# EAGLE design Curvetracer-Mk1 (EAGLE 7.7.0)
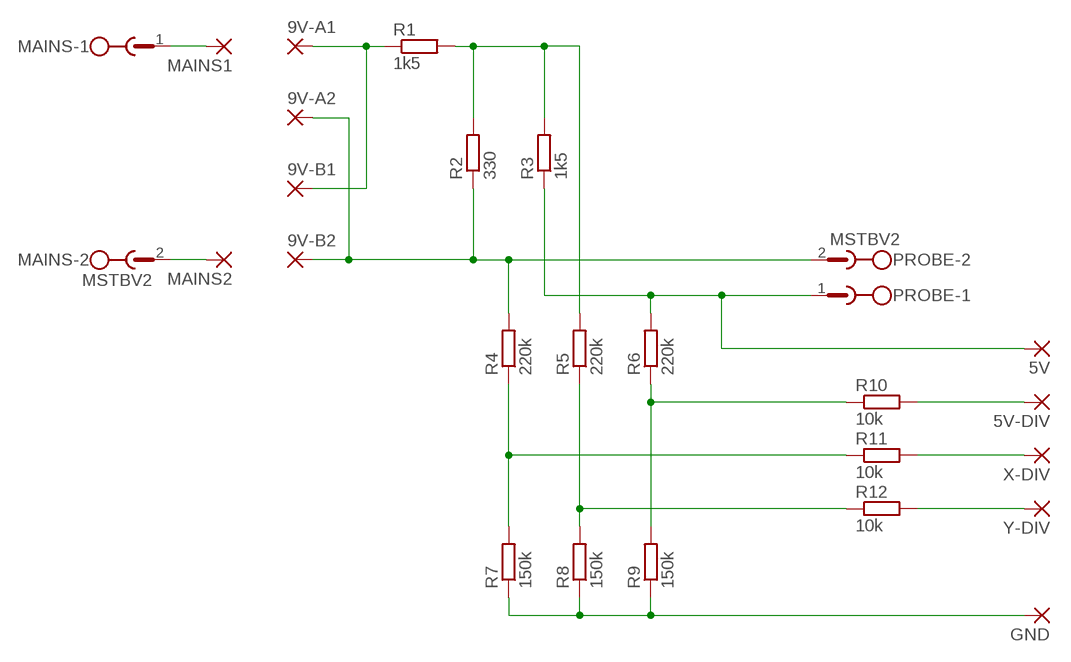
[diagram p0: schematic, sheet 1]

## Parts
5V  2,15/1,0  [2,15/1,0]
5V-DIV  2,15/1,0  [2,15/1,0]
9V-A1  2,15/1,0  [2,15/1,0]
9V-A2  2,15/1,0  [2,15/1,0]
9V-B1  2,15/1,0  [2,15/1,0]
9V-B2  2,15/1,0  [2,15/1,0]
GND  2,15/1,0  [2,15/1,0]
MAINS  MSTBV2  [MSTBV2]
MAINS1  2,15/1,0  [2,15/1,0]
MAINS2  2,15/1,0  [2,15/1,0]
PROBE  MSTBV2  [MSTBV2]
R1  1k5  R-EU_M0805  [M0805]
R2  330  R-EU_M0805  [M0805]
R3  1k5  R-EU_M0805  [M0805]
R4  220k  R-EU_M0805  [M0805]
R5  220k  R-EU_M0805  [M0805]
R6  220k  R-EU_M0805  [M0805]
R7  150k  R-EU_M0805  [M0805]
R8  150k  R-EU_M0805  [M0805]
R9  150k  R-EU_M0805  [M0805]
R10  10k  R-EU_M0805  [M0805]
R11  10k  R-EU_M0805  [M0805]
R12  10k  R-EU_M0805  [M0805]
X-DIV  2,15/1,0  [2,15/1,0]
Y-DIV  2,15/1,0  [2,15/1,0]

## Nets
N$1: MAINS1.1(P) MAINS.1
N$2: MAINS2.1(P) MAINS.2
N$3: 9V-A1.1(P) 9V-B1.1(P) R1.1
N$4: 9V-A2.1(P) 9V-B2.1(P) PROBE.2 R2.1 R4.2
N$5: R1.2 R2.2 R3.2 R5.2
N$6: 5V.1(P) PROBE.1 R3.1 R6.2
N$7: R6.1 R9.2 R10.1
N$8: R4.1 R7.2 R11.1
N$9: R5.1 R8.2 R12.1
N$10: GND.1(P) R7.1 R8.1 R9.1
N$11: 5V-DIV.1(P) R10.2
N$12: R11.2 X-DIV.1(P)
N$13: R12.2 Y-DIV.1(P)

## Library data of the parts
5V 5V-DIV 9V-A1 9V-A2 9V-B1 9V-B2 GND MAINS1 MAINS2 X-DIV Y-DIV = wirepad:2,15/1,0: THROUGH-HOLE PAD
MAINS PROBE = con-phoenix-508:MSTBV2: PHOENIX; MPN: MSTBV 2,5/2-GF-5.08; OC_FARNELL: 1792792; OC_NEWARK: 69R9845
R1-R12 = rcl:R-EU_: RESISTOR, European symbol

## Board
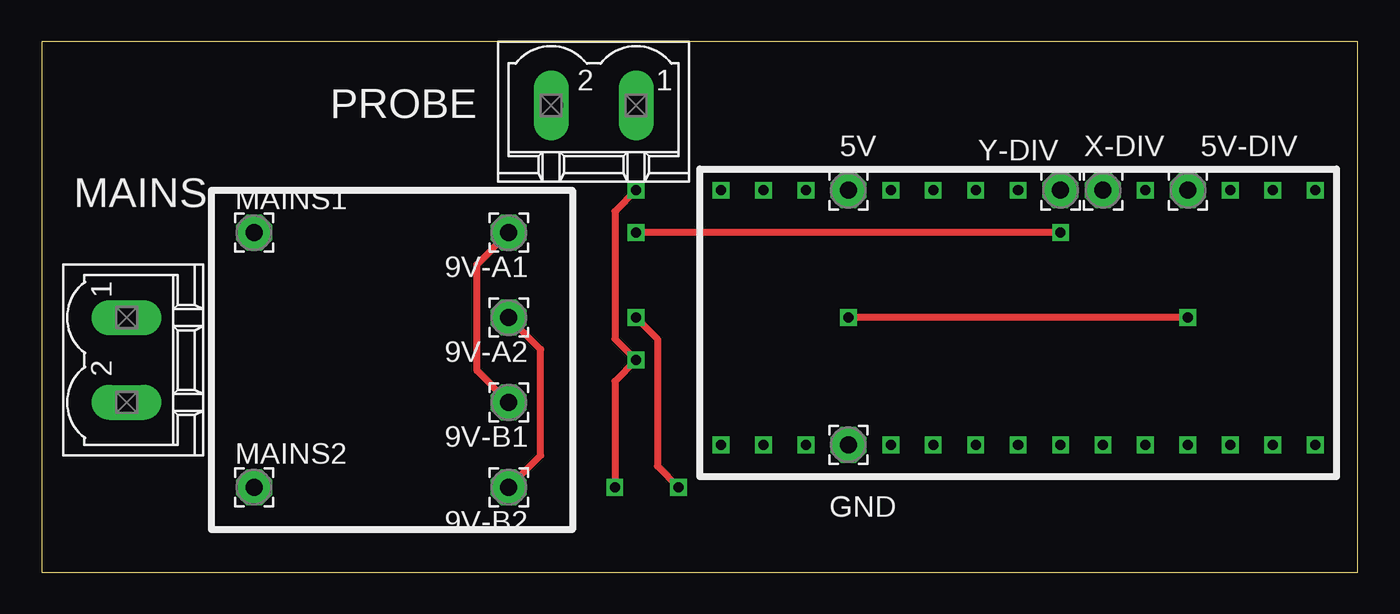
[diagram p1: board, top side]
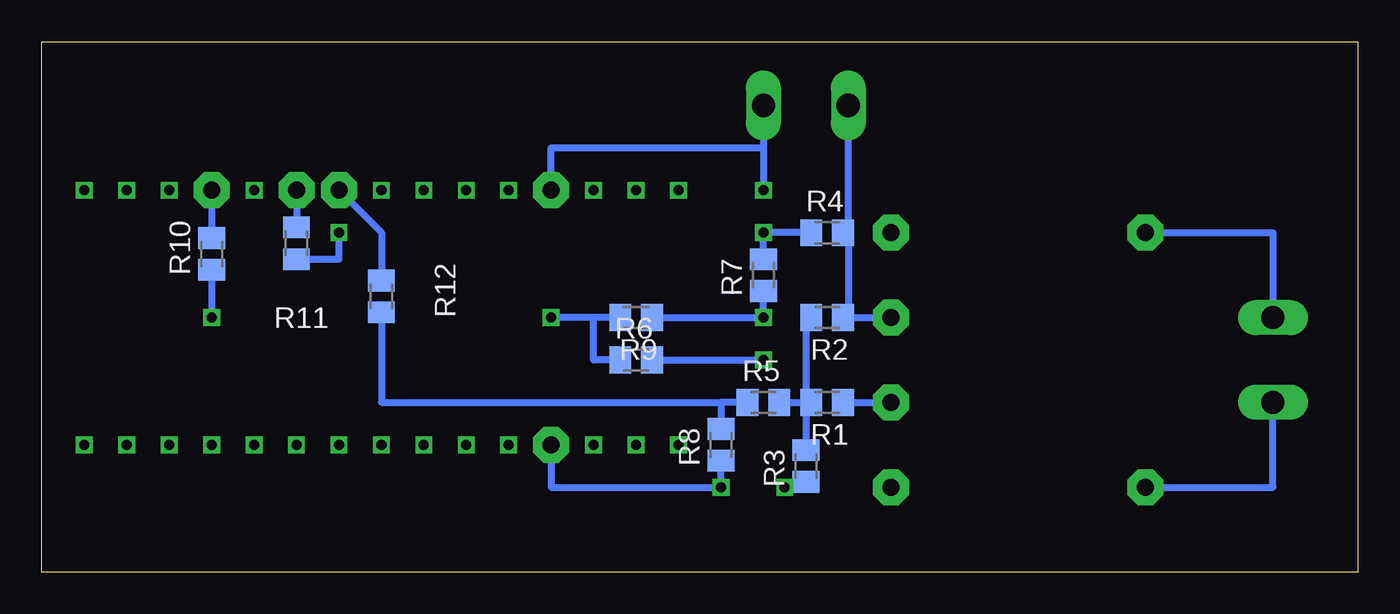
[diagram p2: board, bottom side, seen from below]

Size 78.74 x 31.75 mm. Coordinates in mm from the lower left corner, seen from the top.
Outline: 0,0 78.74,0 78.74,31.75 0,31.75 0,0
Copper layers (1*16): Top 0.035mm / dielectric 1.5mm / Bottom 0.035mm
Design rules "default": minimum track width 10mil, minimum drill 24mil, track to track 8mil, track to pad 8mil, pad to pad 8mil, via to via 8mil, smd to smd 8mil, copper to edge 40mil, drill to drill 8mil, minimum pad ring 10mil, minimum via ring 8mil, stop-mask expansion 4mil, vias tented up to drill 0mil, thermal gap 10mil

### Footprints (pad centres in the part's own frame; a part is rotated, then mirrored left to right if it is on the bottom)
2,15/1,0 = drill 1.016 pad 2.159 octagon: 1 0,0
MSTBV2 = drill 1.397 long: 1 -2.54,0; 2 2.54,0
M0805 = smd 1.3 x 1.6: 1 -0.95,0; 2 0.95,0

### Placement (x,y rotation side)
5V  48.26,22.86 0 top
5V-DIV  68.58,22.86 0 top
9V-A1  27.94,20.32 180 top
9V-A2  27.94,15.24 180 top
9V-B1  27.94,10.16 180 top
9V-B2  27.94,5.08 180 top
GND  48.26,7.62 0 top
MAINS  5.08,12.7 270 top
MAINS1  12.7,20.32 0 top
MAINS2  12.7,5.08 0 top
PROBE  33.02,27.94 180 top
R1  31.75,10.16 180 bottom
R2  31.75,15.24 180 bottom
R3  33.02,6.35 90 bottom
R4  31.75,20.32 0 bottom
R5  35.56,10.16 0 bottom
R6  43.18,12.7 0 bottom
R7  35.56,17.78 90 bottom
R8  38.1,7.62 90 bottom
R9  43.18,15.24 180 bottom
R10  68.58,19.05 90 bottom
R11  63.5,19.68 90 bottom
R12  58.42,16.51 90 bottom
X-DIV  63.5,22.86 90 top
Y-DIV  60.96,22.86 90 top

### Tracks (layer width: path | path; a pad name or v marks a point on that pad's centre or on a via)
N$1
  Bottom 0.406: MAINS1.1 5.08,20.32 MAINS.1
N$2
  Bottom 0.406: MAINS2.1 5.08,5.08 MAINS.2
N$3
  Top 0.406: 9V-B1.1 26.04,12.06 26.04,18.41 9V-A1.1
  Bottom 0.406: R1.1 9V-B1.1
N$4
  Top 0.406: 9V-B2.1 29.84,6.99 29.84,13.34 9V-A2.1
  Bottom 0.406: 30.48,15.24 9V-A2.1 | 30.48,20.32 30.48,15.24 | 30.48,15.24 R2.1 | R4.2 30.48,20.32 | 30.48,20.32 PROBE.2
N$5
  Bottom 0.406: 33.02,10.16 R3.2 | 33.02,10.16 33.02,15.24 R2.2 | 33.02,10.16 R1.2 | R5.2 33.02,10.16
N$6  (via drill 0.6)
  Top 0.406: v35.56,22.86 34.29,21.59 34.29,13.97 v35.56,12.7 34.29,11.43 v34.29,5.08
  Bottom 0.406: v34.29,5.08 33.02,5.08 R3.1 | 5V.1 48.26,25.4 35.56,25.4 | PROBE.1 35.56,25.4 | 35.56,25.4 v35.56,22.86 | R6.2 v35.56,12.7
N$7  (via drill 0.6)
  Top 0.406: v68.58,15.24 v48.26,15.24
  Bottom 0.406: R10.1 v68.58,15.24 | R9.2 45.72,15.24 | R6.1 45.72,12.7 45.72,15.24 | 45.72,15.24 v48.26,15.24
N$8  (via drill 0.6)
  Top 0.406: v60.96,20.32 v35.56,20.32
  Bottom 0.406: R4.1 v35.56,20.32 R7.2 | R11.1 60.96,18.73 v60.96,20.32
N$9
  Bottom 0.406: R5.1 38.1,10.16 | 38.1,10.16 R8.2 | R12.1 58.42,10.16 38.1,10.16
N$10  (via drill 0.6)
  Top 0.406: v35.56,15.24 36.83,13.97 36.83,6.35 v38.1,5.08
  Bottom 0.406: GND.1 48.26,5.08 v38.1,5.08 R8.1 | R7.1 v35.56,15.24 R9.1
N$11
  Bottom 0.406: 5V-DIV.1 R10.2
N$12
  Bottom 0.406: X-DIV.1 R11.2
N$13
  Bottom 0.406: Y-DIV.1 58.42,20.32 R12.2
N$14  (via drill 0.6)
  other vias: 43.18,22.86
N$15  (via drill 0.6)
  other vias: 40.64,7.62
N$16  (via drill 0.6)
  other vias: 45.72,22.86
N$17  (via drill 0.6)
  other vias: 40.64,22.86
N$18  (via drill 0.6)
  other vias: 50.8,22.86
N$19  (via drill 0.6)
  other vias: 53.34,22.86
N$20  (via drill 0.6)
  other vias: 55.88,22.86
N$21  (via drill 0.6)
  other vias: 58.42,22.86
N$22  (via drill 0.6)
  other vias: 71.12,22.86
N$23  (via drill 0.6)
  other vias: 66.04,22.86
N$24  (via drill 0.6)
  other vias: 73.66,22.86
N$25  (via drill 0.6)
  other vias: 73.66,7.62
N$26  (via drill 0.6)
  other vias: 71.12,7.62
N$27  (via drill 0.6)
  other vias: 68.58,7.62
N$28  (via drill 0.6)
  other vias: 66.04,7.62
N$29  (via drill 0.6)
  other vias: 63.5,7.62
N$30  (via drill 0.6)
  other vias: 60.96,7.62
N$31  (via drill 0.6)
  other vias: 58.42,7.62
N$32  (via drill 0.6)
  other vias: 76.2,22.86
N$33  (via drill 0.6)
  other vias: 76.2,7.62
N$34  (via drill 0.6)
  other vias: 55.88,7.62
N$35  (via drill 0.6)
  other vias: 53.34,7.62
N$36  (via drill 0.6)
  other vias: 50.8,7.62
N$37  (via drill 0.6)
  other vias: 45.72,7.62
N$38  (via drill 0.6)
  other vias: 43.18,7.62